# Altium schematic sheet [14]-MAIN_CONNECTORS.SchDoc
size A4
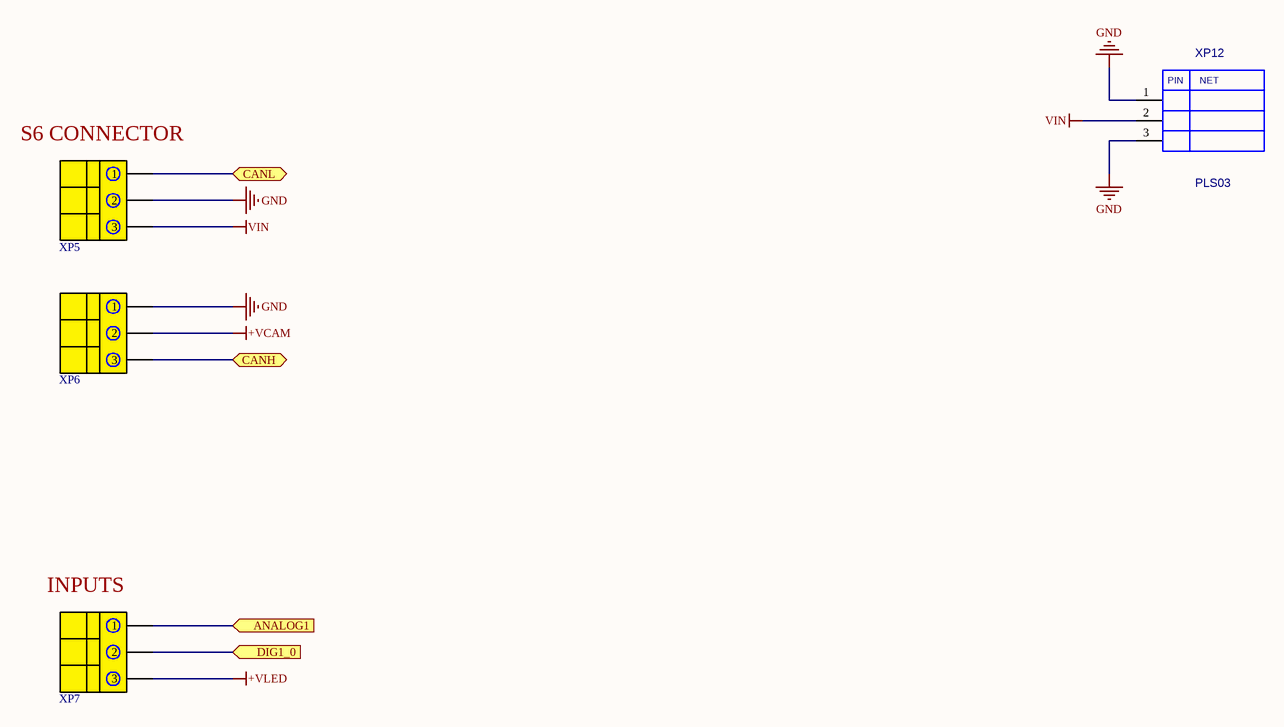
[diagram p0: [14]-MAIN_CONNECTORS.SchDoc]

## Parts
XP5  DG330-3PIN  [DG330-3P]  (value not drawn)
XP6  DG330-3PIN  [DG330-3P]  (value not drawn)
XP7  DG330-3PIN  [DG330-3P]  (value not drawn)
XP12  PLS03  [PLS-03]

## Ports
ANALOG1 (in), CANH (bidir), CANL (bidir), DIG1_0 (in)

## Nets
+VCAM: XP6.2
+VLED: XP7.3
GND: XP5.2 XP6.1 XP12.1 XP12.3
VIN: XP5.3 XP12.2
ANALOG1: XP7.1 ; port ANALOG1
CANH: XP6.3 ; port CANH
CANL: XP5.1 ; port CANL
DIG1_0: XP7.2 ; port DIG1_0

## Notes on the sheet
- (near XP5) S6 CONNECTOR
- (near XP7) INPUTS
- (in symbol PLS03) PIN; NET

## Library data of the parts
XP5-XP7 = DG330-3P: Degson 3 pin connector rear; Value: DG330-3PIN
XP12 = PLS03: Value: *